# EAGLE design Sprite (EAGLE 6.4)
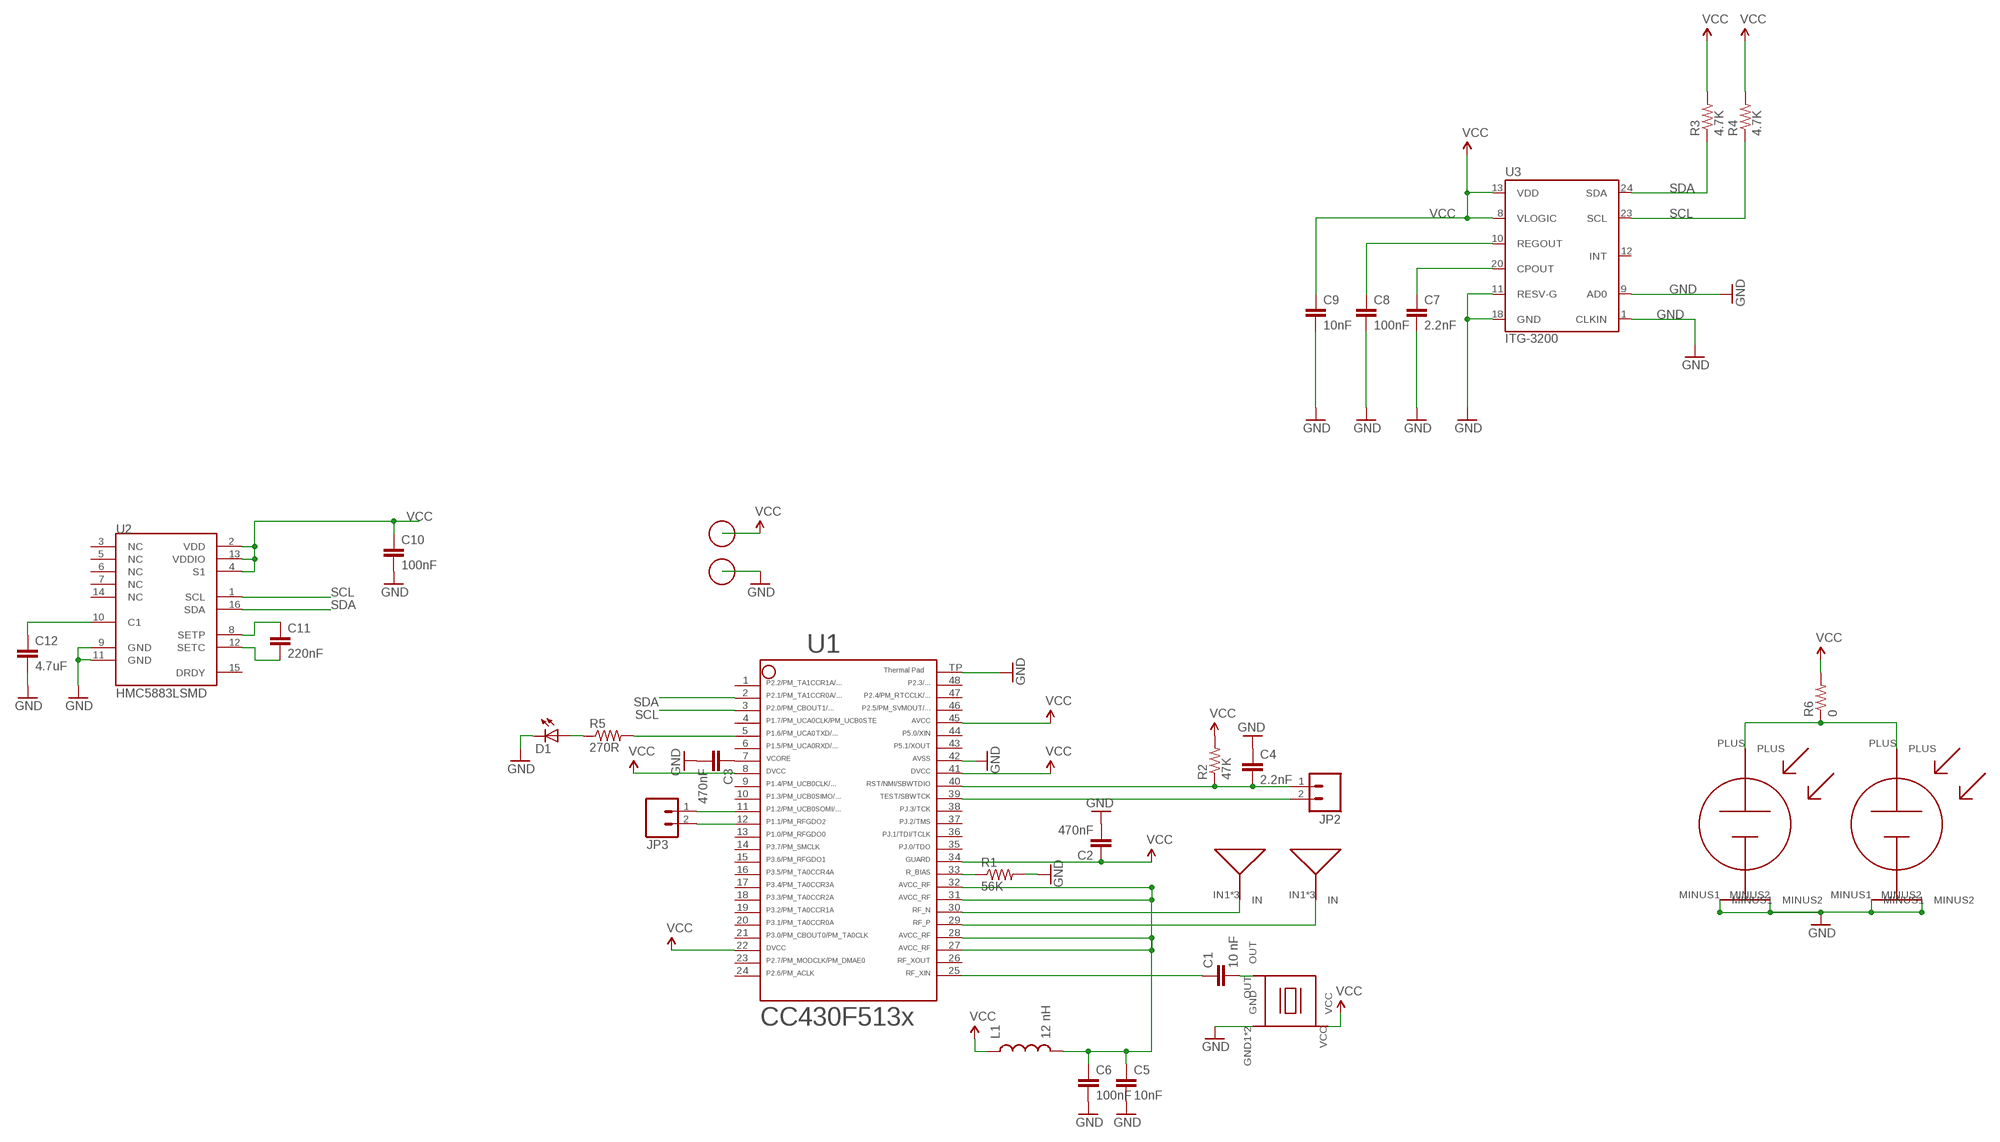
[diagram p0: schematic, sheet 1]

## Parts
ANT-N  ANTENNA  [ANTENNA]
ANT-P  ANTENNA  [ANTENNA]
C1  10 nF  CAP0603-CAP  [0603-CAP]
C2  470nF  CAP0603-CAP  [0603-CAP]
C3  470nF  CAP0603-CAP  [0603-CAP]
C4  2.2nF  CAP0603-CAP  [0603-CAP]
C5  10nF  CAP0603-CAP  [0603-CAP]
C6  100nF  CAP0603-CAP  [0603-CAP]
C7  2.2nF  CAP0603-CAP  [0603-CAP]
C8  100nF  CAP0603-CAP  [0603-CAP]
C9  10nF  CAP0603-CAP  [0603-CAP]
C10  100nF  CAP0603-CAP  [0603-CAP]
C11  220nF  CAP0603-CAP  [0603-CAP]
C12  4.7uF  CAP0603-CAP  [0603-CAP]
D1  LED0603  [LED-0603]
JP2  M02PTH  [1X02]
JP3  M02PTH  [1X02]
L1  12 nH  INDUCTOR0603  [0603]
P1  SPRITE_PIN  [SPRITE_PIN]
P2  SPRITE_PIN  [SPRITE_PIN]
R1  56K  RESISTOR0603-RES  [0603-RES]
R2  47K  RESISTOR0603-RES  [0603-RES]
R3  4.7K  RESISTOR0603-RES  [0603-RES]
R4  4.7K  RESISTOR0603-RES  [0603-RES]
R5  270R  RESISTOR0603-RES  [0603-RES]
R6  0  R-US_R0805  [R0805]
S1  TASC  [TASC]
S2  TASC  [TASC]
U1  CC430F5137  CC430F513X---RGZ48  [RGZ48]
U2  HMC5883LSMD  [16LPCC]
U3  ITG-3200  [QFN-24]
X1  TCXO_7Z  [TXC_7Z]

## Nets
GND: C2.2 C3.2 C4.1 C5.2 C6.2 C7.2 C8.2 C9.2 C10.2 C12.2 D1.C R1.2 S1.MINUS1 S1.MINUS2 S2.MINUS1 S2.MINUS2 U1.42 U1.TP U2.9(GND) U2.11(GND) U3.1(CLKIN) U3.9(AD0) U3.11(RESV-G) U3.18(GND) X1.GND1(GND) X1.GND2(GND)
N$1: C1.1 U1.25
N$3: R1.1 U1.33
N$4: C3.1 U1.7
N$5: C11.1 U2.8(SETP)
N$6: C11.2 U2.12(SETC)
N$7: C12.1 U2.10(C1)
N$8: C7.1 U3.20(CPOUT)
N$9: C8.1 U3.10(REGOUT)
N$10: R5.2 U1.5
N$11: D1.A R5.1
N$12: C1.2 X1.OUT
RFN: ANT-N.IN1(IN) ANT-N.IN2(IN) ANT-N.IN3(IN) U1.30
RFP: ANT-P.IN1(IN) ANT-P.IN2(IN) ANT-P.IN3(IN) U1.29
RST: C4.2 JP2.1 R2.1 U1.40
RXD: JP3.2 U1.12
SCL: R4.1 U1.3 U2.1(SCL) U3.23(SCL)
SDA: R3.1 U1.2 U2.16(SDA) U3.24(SDA)
TEST: JP2.2 U1.39
TXD: JP3.1 U1.11
VCC: C2.1 C9.1 C10.1 L1.1 R2.2 R3.2 R4.2 R6.2 U1.8 U1.22 U1.34 U1.41 U1.45 U2.2(VDD) U2.4(S1) U2.13(VDDIO) U3.8(VLOGIC) U3.13(VDD) X1.VCC
VCCRF: C5.1 C6.1 L1.2 U1.27 U1.28 U1.31 U1.32
VSOLAR: R6.1 S1.PLUS S2.PLUS
Unconnected: U1.1 U1.4 U1.6 U1.9 U1.10 U1.13 U1.14 U1.15 U1.16 U1.17 U1.18 U1.19 U1.20 U1.21 U1.23 U1.24 U1.26 U1.35 U1.36 U1.37 U1.38 U1.43 U1.44 U1.46 U1.47 U1.48 U2.3(NC) U2.5(NC) U2.6(NC) U2.7(NC) U2.14(NC) U2.15(DRDY) U3.12(INT)

## Library data of the parts
ANT-N ANT-P = SpriteAntenna:ANTENNA
C1-C12 = SparkFun:CAP: Capacitor Standard 0603 ceramic capacitor, and 0.1" leaded capacitor.
D1 = SparkFun:LED: LEDs Standard schematic elements and footprints for 5mm, 3mm, 1206, and 0603 sized LEDs. 5mm - Spark Fun Electronics SKU : COM-00529 (and others)
JP2 JP3 = SparkFun:M02: Header 2 Standard 2-pin 0.1" header. Use with straight break away headers (SKU : PRT-00116), right angle break away headers (PRT-00553), swiss pins (PRT-00743), machine pins (PRT-00117), and female headers (PRT-00115). Molex polarized connector foot print use with SKU : PRT-08233 with associated crimp pins and housings.
L1 = SparkFun:INDUCTOR: Inductors Basic Inductor/Choke - 0603 and 1206. Footprints are not proven and vary greatly between part numbers.
P1 P2 = SpritePin:SPRITE_PIN
R1-R5 = SparkFun:RESISTOR: Resistor Basic schematic elements and footprints for 0603, 1206, and PTH resistors.
R6 = rcl:R-US_: RESISTOR, American symbol
S1 S2 = TASC:TASC
U1 = TI_MSP430_v16:CC430F513X---RGZ48: ***CC430F513X***RGZ48 ** ** Rev 1.0 ** 06/2010 * http://focus.ti.com/docs/prod/folders/print/cc430f5137.html
U2 = SparkFun:HMC5883L: 3 Axis Digital Compass IC
U3 = SparkFun:ITG-3200: ITG-3200 3-axis gyro, digital output, qfn24 package
X1 = SpriteTCXO:TCXO_7Z

## Board
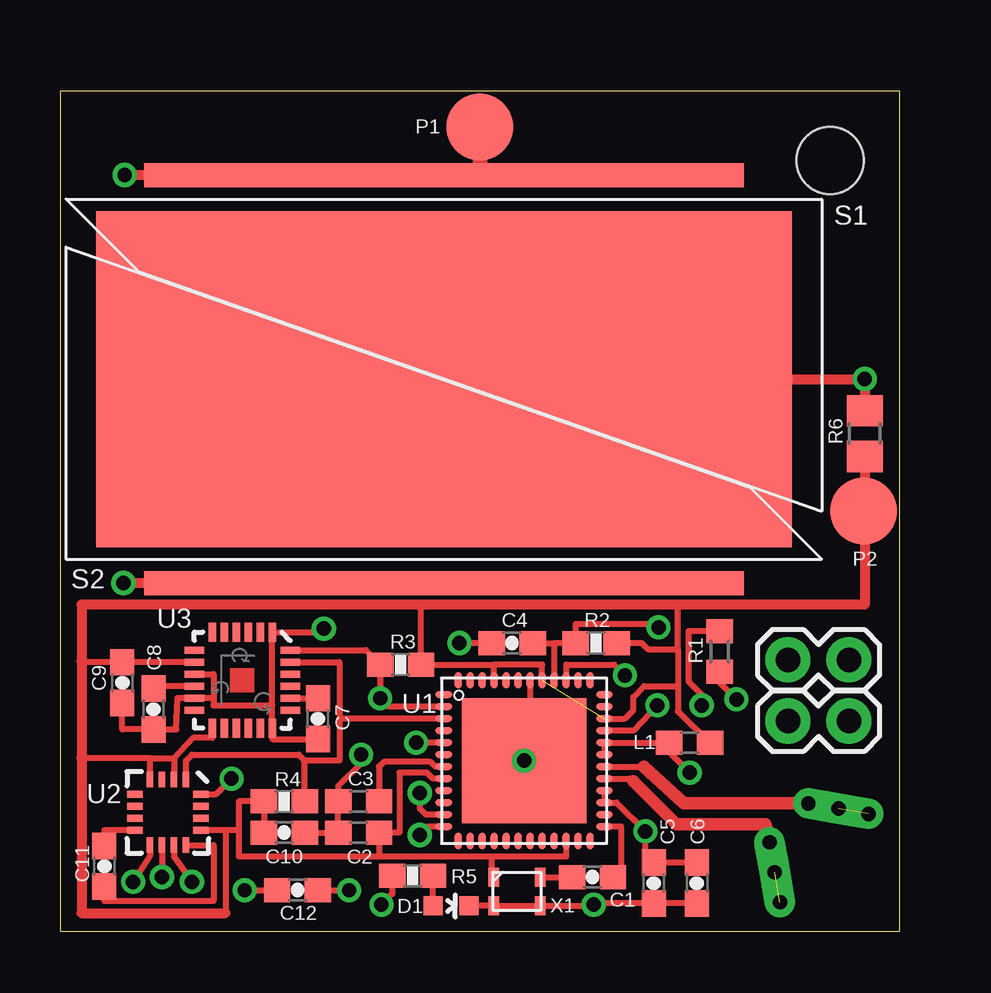
[diagram p1: board, top side]
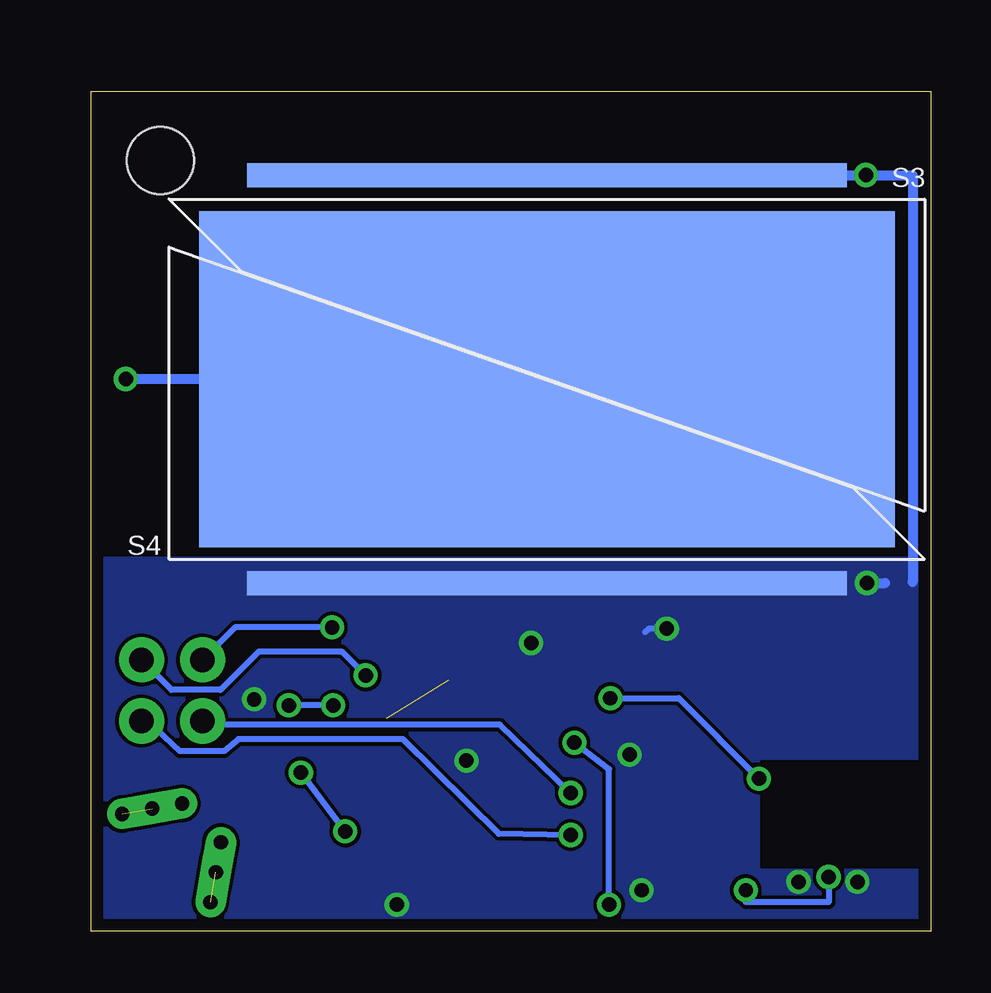
[diagram p2: board, bottom side, seen from below]

Size 35 x 35 mm. Coordinates in mm from the lower left corner, seen from the top.
Outline: 0,0 35,0 35,35 0,35 0,0
Copper layers (1*16): Top 0.0178mm / dielectric 59mil / Bottom 0.0178mm
Design rules "SSC-EAGLE-2Lyr_v1.0.0.3": minimum track width 6mil, minimum drill 14mil, track to track 6mil, track to pad 6mil, pad to pad 6mil, via to via 6mil, smd to smd 6mil, copper to edge 20mil, drill to drill 16mil, minimum pad ring 8mil, minimum via ring 8mil, stop-mask expansion 3mil, vias tented up to drill 0mil, thermal gap 10mil
Holes 2.8 mm at 32.1,32.1

### Footprints (pad centres in the part's own frame; a part is rotated, then mirrored left to right if it is on the bottom)
ANTENNA = drill 0.6 pad 1.27 square: IN1 0,0 | drill 0.6 pad 1.27 offset: IN2 1.27,0; IN3 -1.27,0
0603-CAP = smd 1.1 x 1: 1 -0.85,0; 2 0.85,0
C0603 = smd 1.1 x 1: 1 -0.85,0; 2 0.85,0
LED-0603 = smd 0.8 x 0.8: A 0,-0.75; C 0,0.75
1X02 = drill 1.016 pad 1.88: 1 0,0; 2 2.54,0
0603 = smd 1.1 x 1: 1 -0.85,0; 2 0.85,0
SPRITE_PIN = smd 2.794 x 2.794: PIN 0,0
R0603 = smd 1 x 1.1: 1 -0.85,0; 2 0.85,0
0603-RES = smd 1.1 x 1: 1 -0.85,0; 2 0.85,0
R0805 = smd 1.3 x 1.5: 1 -0.95,0; 2 0.95,0
TASC = smd 25 x 1: MINUS1 0,8.5; MINUS2 0,-8.5 | smd 29 x 14: PLUS 0,0
RGZ48 = smd 0.7 x 0.3: 1 -3.35,2.75; 2 -3.35,2.25; 3 -3.35,1.75; 4 -3.35,1.25; 5 -3.35,0.75; 6 -3.35,0.25; 7 -3.35,-0.25; 8 -3.35,-0.75; 9 -3.35,-1.25; 10 -3.35,-1.75; 11 -3.35,-2.25; 12 -3.35,-2.75; 25 3.35,-2.75; 26 3.35,-2.25; 27 3.35,-1.75; 28 3.35,-1.25; 29 3.35,-0.75; 30 3.35,-0.25; 31 3.35,0.25; 32 3.35,0.75; 33 3.35,1.25; 34 3.35,1.75; 35 3.35,2.25; 36 3.35,2.75 | smd 0.3 x 0.7: 13 -2.75,-3.35; 14 -2.25,-3.35; 15 -1.75,-3.35; 16 -1.25,-3.35; 17 -0.75,-3.35; 18 -0.25,-3.35; 19 0.25,-3.35; 20 0.75,-3.35; 21 1.25,-3.35; 22 1.75,-3.35; 23 2.25,-3.35; 24 2.75,-3.35; 37 2.75,3.35; 38 2.25,3.35; 39 1.75,3.35; 40 1.25,3.35; 41 0.75,3.35; 42 0.25,3.35; 43 -0.25,3.35; 44 -0.75,3.35; 45 -1.25,3.35; 46 -1.75,3.35; 47 -2.25,3.35; 48 -2.75,3.35 | smd 5.2 x 5.2: TP 0,0
16LPCC = smd 0.65 x 0.28: 1 -1.37,0.75; 2 -1.37,0.25; 3 -1.37,-0.25; 4 -1.37,-0.75; 9 1.37,-0.75; 10 1.37,-0.25; 11 1.37,0.25; 12 1.37,0.75 | smd 0.28 x 0.65: 5 -0.75,-1.37; 6 -0.25,-1.37; 7 0.25,-1.37; 8 0.75,-1.37; 13 0.75,1.37; 14 0.25,1.37; 15 -0.25,1.37; 16 -0.75,1.37
QFN-24 = smd 0.8 x 0.3: 1 -2,1.25; 2 -2,0.75; 3 -2,0.25; 4 -2,-0.25; 5 -2,-0.75; 6 -2,-1.25; 13 2,-1.25; 14 2,-0.75; 15 2,-0.25; 16 2,0.25; 17 2,0.75; 18 2,1.25 | smd 0.3 x 0.8: 7 -1.25,-2; 8 -0.75,-2; 9 -0.25,-2; 10 0.25,-2; 11 0.75,-2; 12 1.25,-2; 19 1.25,2; 20 0.75,2; 21 0.25,2; 22 -0.25,2; 23 -0.75,2; 24 -1.25,2
TXC_7Z = smd 0.44 x 0.79: GND1 -0.97,-0.595; GND2 0.97,-0.595; OUT 0.97,0.595; VCC -0.97,0.595

### Placement (x,y rotation side)
ANT-N  32.45,5.1 170 top
ANT-P  29.8,2.45 100 top
C1  22.2,2.25 180 top
C2  470nF  [C0603]  12.45,4.1 180 top
C3  470nF  [C0603]  12.45,5.4 180 top
C4  18.85,12 0 top
C5  24.75,2 270 top
C6  26.55,2 270 top
C7  10.75,8.85 270 top
C8  3.9,9.25 270 top
C9  2.6,10.35 270 top
C10  9.35,4.1 0 top
C11  1.85,2.7 270 top
C12  9.9,1.7 0 top
D1  16.3,1.05 270 top
JP2  30.35,11.3 0 top
JP3  30.35,8.75 0 top
L1  26.25,7.85 180 top
P1  17.5,33.5 0 top
P2  33.5,17.5 0 top
R1  56K  [R0603]  27.5,11.65 270 top
R2  22.35,12 0 top
R3  14.2,11.1 0 top
R4  9.35,5.4 180 top
R5  14.7,2.3 180 top
R6  33.55,20.73 270 top
S1  16,23 0 top
S2  16,23 0 bottom
U1  19.35,7.1 0 top
U2  4.5,4.95 270 top
U3  7.6,10.45 270 top
X1  19.05,1.65 0 top

### Tracks (layer width: path | path; a pad name or v marks a point on that pad's centre or on a via)
GND  (via drill 0.6, 0.6 pad 0.25)
  Top 0.254: C7.2 8.85,8 U3.18 8.85,9.4 | C4.1 v16.65,12 | U1.42 19.6,7.75 U1.TP | C6.2 C5.2 | C5.2 24.8,1.1 | U3.9 6.4,10.7 6.4,9.7 | 6.4,9.7 U3.11 4.9,9.7 4.85,8.4 C8.2 2.6,8.4 C9.2 | 6.4,9.7 6.4,9.4 8.85,9.4 | R1.2 27.5,10.35 v28.2,9.65 | C10.2 C2.2 C3.2 11.6,6.05 12.55,7 v12.55,7.35 | U2.9 3.75,3.15 v3.05,2.05 | U2.11 4.75,3.1 v5.5,2.05 | C12.2 v12.05,1.7 | C5.2 22.3,1.15 v22.25,1.1 22.2,1.05 X1.GND2 X1.GND1 D1.C | v11,12.6 10.85,12.45 U3.1 8.85,9.4
  Top 0.406: 17.5,31.5 S2.MINUS1 v2.7,31.5 | 16,14.55 S2.MINUS2 v2.65,14.5
  Top 0.61: 17.5,31.5 17.5,33.5
  Bottom 0.254: v11,12.6 11.75,12.6 11.9,12.45
  Bottom 0.406: S2.MINUS1 v2.7,31.5 0.75,31.5 0.75,14.55 | v2.65,14.5 1.9,14.5
  other vias: 19.35,7.1
  pour Bottom (no thermals): 0,0 35,0 35,15.5 0,15.5 0,7.25 7.25,7.25 7.25,2.5 0,2.5
N$1
  Top 0.254: C1.1 23.4,2.35 23.4,4.35 U1.25
N$3  (via drill 0.6)
  Top 0.254: R1.1 26.2,12.5 26.2,10.4 26.75,9.85 v26.75,9.4 | U1.33 23.9,8.35 v24.9,9.4
  Bottom 0.254: v24.9,9.4 v26.75,9.4
N$4
  Top 0.254: C3.1 13.3,6.85 13.5,7.05 15.45,7.05 15.65,6.85 U1.7
N$5
  Top 0.254: U2.8 1.85,4.2 C11.1
N$6
  Top 0.254: U2.12 6.4,3.58 6.4,1.25 1.85,1.25 C11.2
N$7  (via drill 0.6)
  Top 0.254: U2.10 v4.25,2.25 | v7.7,1.7 C12.1
  Bottom 0.254: v4.25,2.25 4.25,1.2 7.7,1.2 v7.7,1.7
N$8
  Top 0.254: U3.20 C7.1
N$9
  Top 0.254: U3.10 3.9,10.2 C8.1
N$10  (via drill 0.6)
  Top 0.254: R5.2 13.85,1.55 v13.4,1.1 | U1.5 v14.85,7.85
  Bottom 0.254: v13.4,1.1 13.4,6.75 v14.85,7.85
N$11
  Top 0.254: D1.A R5.1 15.55,2.4
N$12
  Top 0.254: X1.OUT 21.15,2.25 C1.2
RFN  (1 unrouted)
  Top 0.254: U1.30 24.35,6.85
  Top 0.53: ANT-N.IN3 ANT-N.IN2 26,5.33 24.35,6.85
RFP  (1 unrouted)
  Top 0.254: U1.29 23.75,6.35 23.9,6.25
  Top 0.53: ANT-P.IN3 ANT-P.IN2 29.4,4.45 25.7,4.45 23.9,6.25
RST  (via drill 0.6)
  Top 0.254: 20.6,12 U1.40 | C4.2 20.6,12 | 20.6,12 R2.1 21.5,12.8 24.75,12.8 v24.95,12.65
  Bottom 0.254: v24.95,12.65 29,12.65 JP2.1
RXD  (via drill 0.6)
  Top 0.254: U1.12 15.35,4.35 v15,4
  Bottom 0.254: v15,4 18,4.05 22,8 28.85,8 29.45,7.5 31.3,7.5 32.64,8.74 JP3.2
SCL
  Top 0.254: U3.23 11.65,11.2 11.65,8.85 | 11.65,8.85 11.65,7.1 10.2,7.1 | U2.1 5.25,7.1 5.5,7.35 9.95,7.35 10.2,7.1 | U1.3 11.65,8.85 | R4.1 10.2,7.1
SDA  (via drill 0.6)
  Top 0.254: U1.2 13.7,9.35 v13.35,9.7 R3.1 12.75,11.7 U3.24 | U2.16 6.5,5.7 v7.15,6.35
  Bottom 0.254: v13.35,9.7 10.5,9.7 v7.15,6.35
TEST  (via drill 0.6)
  Top 0.254: U1.39 21.1,11.1 23.1,11.1 v23.55,10.65
  Bottom 0.254: JP2.2 31.64,10.05 29.6,10.05 28,11.65 24.55,11.65 v23.55,10.65
TXD  (via drill 0.6)
  Top 0.254: U1.11 15.25,4.85 15,5.1 v15,5.75
  Bottom 0.254: v15,5.75 17.95,8.6 30.2,8.6 JP3.1
VCC  (1 unrouted)
  Top 0.254: U2.4 3.75,7.2 | 3.75,7.2 4.75,7.2 | 4.75,7.2 U2.2 | 7.45,4.2 7.45,5.4 R4.2 C10.1 | 7.45,4.2 7.45,3.1 13.3,3.1 | 3.75,7.2 0.9,7.2 | U3.13 6.35,8.05 5.55,8.05 4.75,7.2 | U1.45 18.1,11.1 | U1.41 20.1,11.1 18.1,11.1 | U1.22 21.1,3.1 18,3.1 | 18,3.1 13.3,3.1 | 13.3,3.1 C2.1 14.15,4.1 14.15,6.6 15.3,6.6 15.55,6.35 U1.8 | 25.75,11.75 25.75,10.25 | 25.75,10.25 25.75,9.15 L1.1 | 25.75,11.75 24.5,11.75 24.25,12 R2.2 | X1.VCC 18,2.35 18,3.1 | 25.75,11.75 25.75,13.5 | 18.1,11.1 R3.2 15.05,13.6 | U1.34 23.55,8.85 23.9,9.2 23.9,9.75 24.35,10.2 25.7,10.2 25.75,10.25 | U3.8 C9.1 0.95,11.2 0.9,11.25 | 7.45,4.2 6.9,4.2 | 6.9,4.2 6.9,0.75 | 6.9,4.2 U2.13
  Top 0.406: 6.9,0.75 0.9,0.75 0.9,7.2 0.9,11.25 0.9,13.6 15.05,13.6 33.55,13.6 R6.2
VCCRF  (via drill 0.6)
  Top 0.254: U1.28 U1.27 23.2,5.35 v24.4,4.15 24.4,2.75 C5.1 C6.1 | v26.25,6.6 25.4,7.45 L1.2 U1.32 U1.31
  Bottom 0.254: v24.4,4.15 v26.25,6.6
VSOLAR  (via drill 0.6)
  Top 0.406: S2.PLUS v33.55,23 R6.1
  Bottom 0.406: S2.PLUS v33.55,23

### Text on the board
tNames: P1 | S1 | P2 | S2
bNames: S3 | S4
201bmp: Sprite v2.5